# Altium project PCB_Project_4.PrjPcb
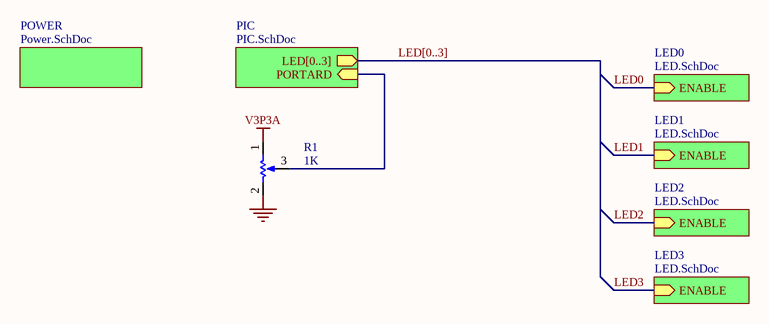
[diagram p0: Sheet4.SchDoc]
4 sheets, 36 parts. Net scope: hierarchical (ports join the sheet entries above them; power ports are global).
Board file: PCB1.PcbDoc
Sheets:
  Sheet4.SchDoc
    LED0 = LED.SchDoc
    LED1 = LED.SchDoc
    LED2 = LED.SchDoc
    LED3 = LED.SchDoc
    PIC = PIC.SchDoc
    POWER = Power.SchDoc

## Sheet Sheet4.SchDoc
size A4

### Parts
R1  1K  [PDB181-K415K-102A2]

### Sub-sheets
LED0 = LED.SchDoc: ENABLE (in)
LED1 = LED.SchDoc: ENABLE (in)
LED2 = LED.SchDoc: ENABLE (in)
LED3 = LED.SchDoc: ENABLE (in)
PIC = PIC.SchDoc: PORTARD (in), LED[0..3] (out)
POWER = Power.SchDoc: no entries

### Nets
GND: R1.2(BOT)
V3P3A: R1.1(TOP)
NetR1_3: R1.3(TAP) ; sheet PIC/PORTARD

### Buses and harness runs
bus LED[0..3] = sheet PIC/LED[0..3]

### Library data of the parts
R1 = RPot: Potentiometer; Fournisseur: Farnell; Fabricant: BOURNS; Ref.Fournisseur: 1823540; Ref.Fabricant: PDB181-K415K-102A2; Valeur: 1K

## Sheet LED.SchDoc
size A
Used 4 times, as channels LED0, LED1, LED2, LED3. Parts and nets are listed once, with the designators drawn on the sheet.
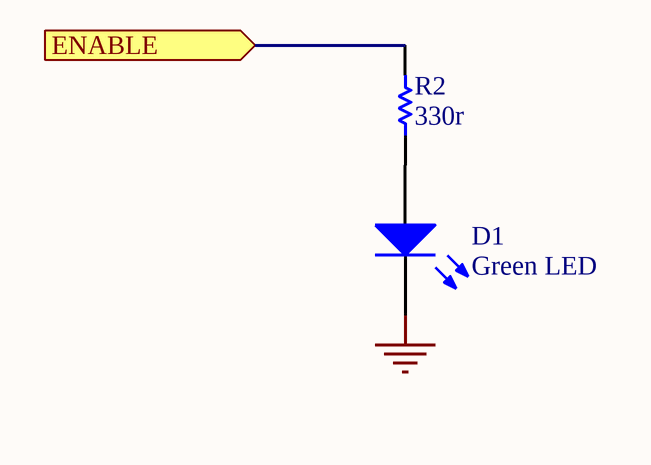
[diagram p1: LED.SchDoc]

### Parts
D1  Green LED  [LED 0805]
R2  330r  [RESC1608N]

### Ports
ENABLE (in)

### Nets
GND: D1.2(K)
ENABLE: R2.2 ; port ENABLE
NetD1_1: D1.1(A) R2.1

### Channels
LED0: designators D1=D1_LED0 R2=R2#1; ports ENABLE=LED0
LED1: designators D1=D1_LED1 R2=R2#2; ports ENABLE=LED1
LED2: designators D1=D1_LED2 R2=R2#3; ports ENABLE=LED2
LED3: designators D1=D1_LED3 R2=R2#4; ports ENABLE=LED3

### Library data of the parts
D1 = LED0: Typical INFRARED GaAs LED; Fournisseur: Farnell; Fabricant: KING BRIGHT; Ref.Fournisseur: 2099239; Ref.Fabricant: KPT-2012SGC
R2 = Res1: Resistor; Value: 1K; Precision: 1%; Published: 8-Jun-2000; LatestRevisionDate: 17-Jul-2002; LatestRevisionNote: Re-released for DXP Platform.; PackageReference: AXIAL-0.3; Publisher: Altium Limited; PackageDescription: Axial Device, Thru-Hole; 2 Leads; 0.3 in Pin Spacing

## Sheet PIC.SchDoc
size A4
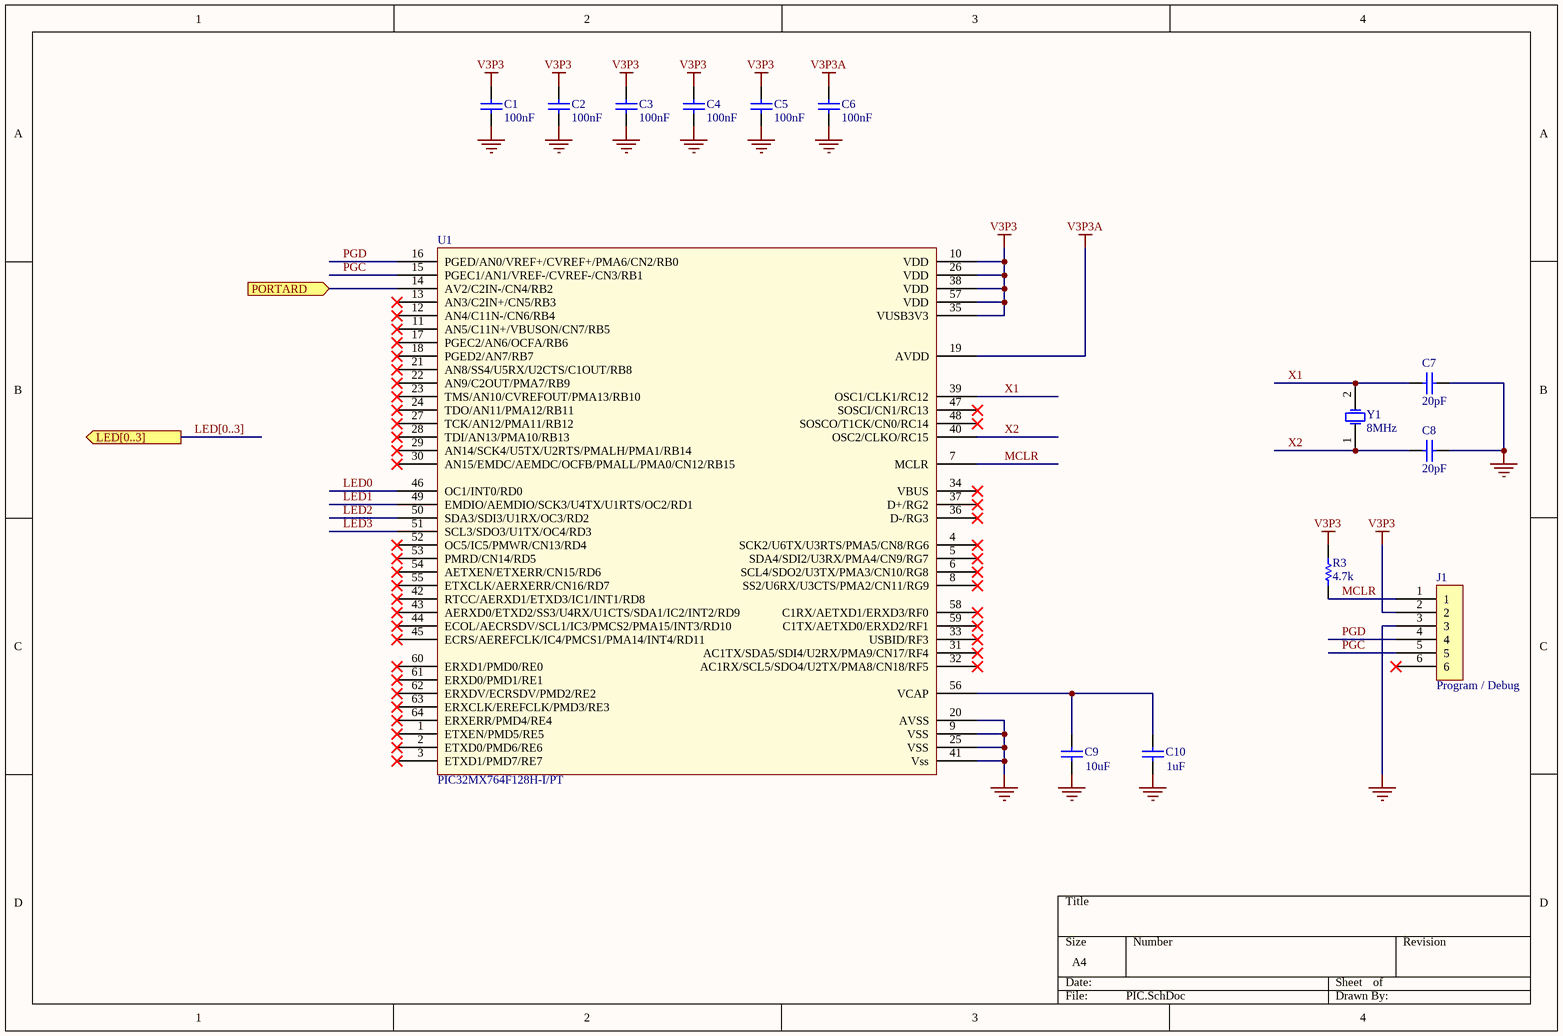
[diagram p2: PIC.SchDoc]

### Parts
C1  100nF  [CAPC1608N]
C2  100nF  [CAPC1608N]
C3  100nF  [CAPC1608N]
C4  100nF  [CAPC1608N]
C5  100nF  [CAPC1608N]
C6  100nF  [CAPC1608N]
C7  20pF  [CAPC1608N]
C8  20pF  [CAPC1608N]
C9  10uF  [CAPC2012N]
C10  1uF  [CAPC1608N]
J1  Program / Debug  [RJ12_90]
R3  4.7k  [RESC1608N]
U1  PIC32MX764F128H-I/PT  [QFP50P1200X1200X120-64]
Y1  8MHz  [HC49/4H SMX Crystal]

### Ports
LED[0..3] (out), PORTARD (in)

### Nets
GND: C1.1 C2.1 C3.1 C4.1 C5.1 C6.1 C7.2 C8.2 C9.1 C10.1 J1.3 U1.9(VSS) U1.20(AVSS) U1.25(VSS) U1.41(Vss)
V3P3: C1.2 C2.2 C3.2 C4.2 C5.2 J1.2 R3.2 U1.10(VDD) U1.26(VDD) U1.35(VUSB3V3) U1.38(VDD) U1.57(VDD)
V3P3A: C6.2 U1.19(AVDD)
LED0: U1.46(OC1/INT0/RD0)
LED1: U1.49(EMDIO/AEMDIO/SCK3/U4TX/U1RTS/OC2/RD1)
LED2: U1.50(SDA3/SDI3/U1RX/OC3/RD2)
LED3: U1.51(SCL3/SDO3/U1TX/OC4/RD3)
MCLR: J1.1 R3.1 U1.7(MCLR)
PGC: J1.5 U1.15(PGEC1/AN1/VREF-/CVREF-/CN3/RB1)
PGD: J1.4 U1.16(PGED/AN0/VREF+/CVREF+/PMA6/CN2/RB0)
X1: C7.1 U1.39(OSC1/CLK1/RC12) Y1.2(OSC2)
X2: C8.1 U1.40(OSC2/CLKO/RC15) Y1.1(OSC1)
NetC9_2: C9.2 C10.2 U1.56(VCAP)
NetR1_3: U1.14(AV2/C2IN-/CN4/RB2) ; port PORTARD

Not connected (* = marked no-connect by the designer): J1 6*; U1 1(ETXEN/PMD5/RE5)* 2(ETXD0/PMD6/RE6)* 3(ETXD1/PMD7/RE7)* 4(SCK2/U6TX/U3RTS/PMA5/CN8/RG6)* 5(SDA4/SDI2/U3RX/PMA4/CN9/RG7)* 6(SCL4/SDO2/U3TX/PMA3/CN10/RG8)* 8(SS2/U6RX/U3CTS/PMA2/CN11/RG9)* 11(AN5/C11N+/VBUSON/CN7/RB5)* 12(AN4/C11N-/CN6/RB4)* 13(AN3/C2IN+/CN5/RB3)* 17(PGEC2/AN6/OCFA/RB6)* 18(PGED2/AN7/RB7)* 21(AN8/SS4/U5RX/U2CTS/C1OUT/RB8)* 22(AN9/C2OUT/PMA7/RB9)* 23(TMS/AN10/CVREFOUT/PMA13/RB10)* 24(TDO/AN11/PMA12/RB11)* 27(TCK/AN12/PMA11/RB12)* 28(TDI/AN13/PMA10/RB13)* 29(AN14/SCK4/U5TX/U2RTS/PMALH/PMA1/RB14)* 30(AN15/EMDC/AEMDC/OCFB/PMALL/PMA0/CN12/RB15)* 31(AC1TX/SDA5/SDI4/U2RX/PMA9/CN17/RF4)* 32(AC1RX/SCL5/SDO4/U2TX/PMA8/CN18/RF5)* 33(USBID/RF3)* 34(VBUS)* 36(D-/RG3)* 37(D+/RG2)* 42(RTCC/AERXD1/ETXD3/IC1/INT1/RD8)* 43(AERXD0/ETXD2/SS3/U4RX/U1CTS/SDA1/IC2/INT2/RD9)* 44(ECOL/AECRSDV/SCL1/IC3/PMCS2/PMA15/INT3/RD10)* 45(ECRS/AEREFCLK/IC4/PMCS1/PMA14/INT4/RD11)* 47(SOSCI/CN1/RC13)* 48(SOSCO/T1CK/CN0/RC14)* 52(OC5/IC5/PMWR/CN13/RD4)* 53(PMRD/CN14/RD5)* 54(AETXEN/ETXERR/CN15/RD6)* 55(ETXCLK/AERXERR/CN16/RD7)* 58(C1RX/AETXD1/ERXD3/RF0)* 59(C1TX/AETXD0/ERXD2/RF1)* 60(ERXD1/PMD0/RE0)* 61(ERXD0/PMD1/RE1)* 62(ERXDV/ECRSDV/PMD2/RE2)* 63(ERXCLK/EREFCLK/PMD3/RE3)* 64(ERXERR/PMD4/RE4)*

### Buses and harness runs
bus LED[0..3] = port LED[0..3]

### Library data of the parts
C1-C8 = Cap: Capacitor; Precision: 50V X5R; Fournisseur: *; Ref. Fournisseur: *; Fabricant: *; Ref. Fabricant: *
  C1-C6: Valeur: 100nF
  C7 C8: Valeur: 20pF
C9 = Cap: Capacitor; Fournisseur: Farnell; Ref.Fournisseur: 2309029; Fabricant: TDK; Ref.Fabricant: C2012X5R0J106M/1.25; Precision: 6.3V X5R 10uF; Valeur: 10uF
C10 = Cap: Capacitor; Precision: 6.3V X5R; Published: 8-Jun-2000; Fournisseur: *; Ref. Fournisseur: *; Fabricant: *; Ref. Fabricant: *; Valeur: 1uF
J1 = Program / Debug: Fournisseur: Farnell; Fabricant: Tyco; Ref.Fournisseur: 1773039; Ref.Fabricant: 1-215876-3
R3 = Res1: Resistor; Precision: 1%; Ref.Fournisseur: *; Ref.Fabricant: *; Fournisseur: *; Fabricant: *; Valeur: 4.7k
U1 = PIC32MX764F128H-I/PT: Fabricant: Microchip; Fournisseur: Farnell; Ref.Fournisseur: 1971889; Ref.Fabricant: PIC32MX764F128H-I/PT
Y1 = XTAL: Crystal Oscillator; Fabricant: FOX ELECTRONICS; Ref.Fabricant: FOXSDLF/080-20; Ref.Fournisseur: 2063972; Fournisseur: Farnell; Valeur: 8MHz

## Sheet Power.SchDoc
size A
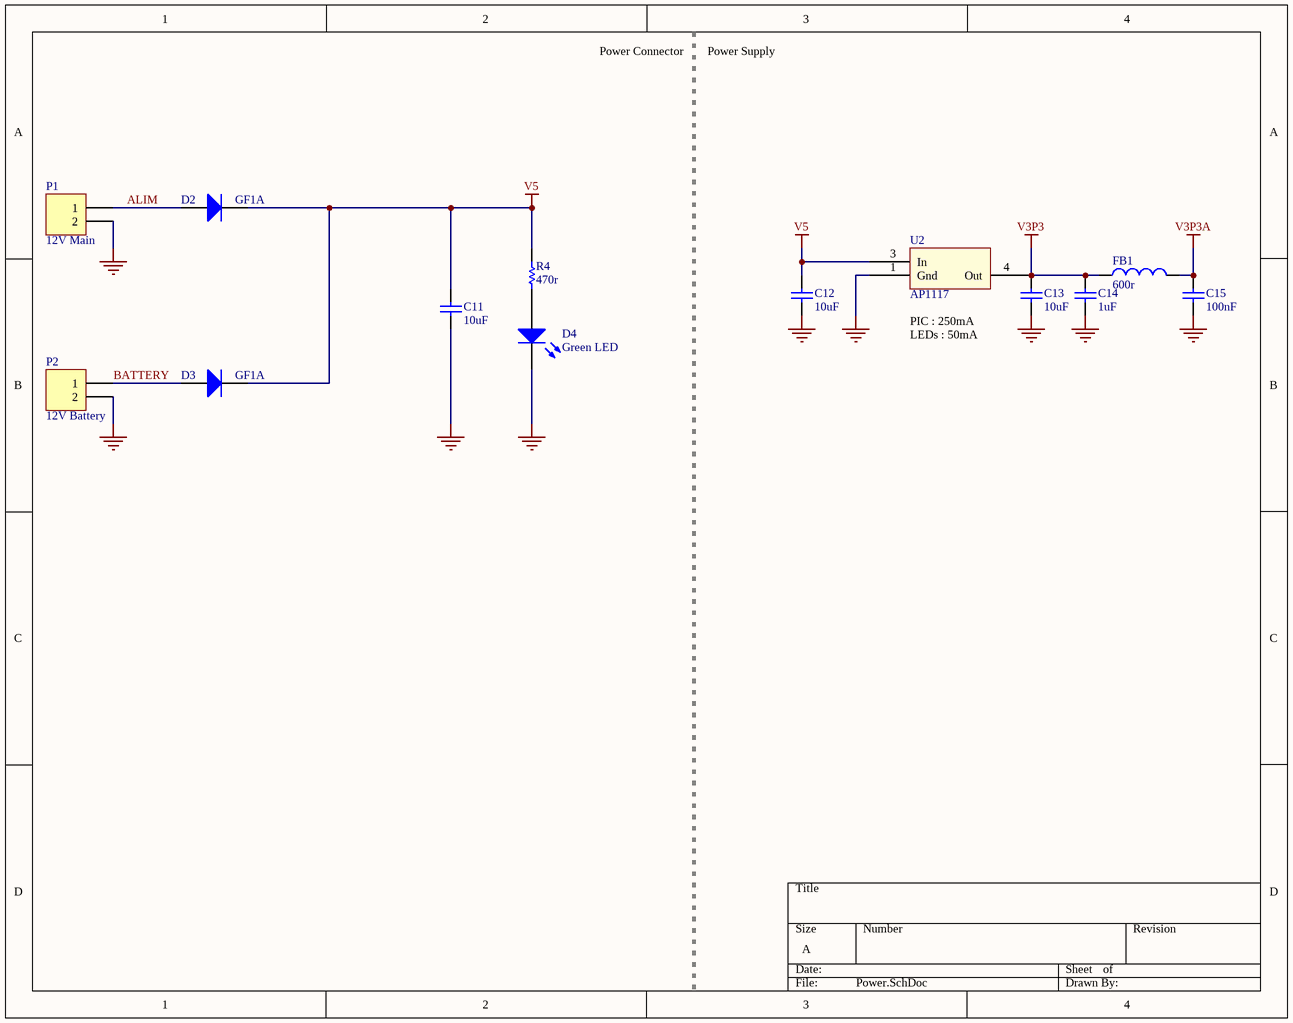
[diagram p3: Power.SchDoc]

### Parts
C11  10uF  [CAPC2012N]
C12  10uF  [CAPC2012N]
C13  10uF  [CAPC2012N]
C14  1uF  [CAPC1608N]
C15  100nF  [CAPC1608N]
D2  GF1A  [214AC_21]
D3  GF1A  [214AC_21]
D4  Green LED  [LED 0805]
FB1  600r  [INDC1608AN]
P1  12V Main  [PHOENIX_1985195]
P2  12V Battery  [PHOENIX_1985195]
R4  470r  [RESC1608N]
U2  AP1117  [TD03B_N]

### Nets
GND: C11.1 C12.1 C13.1 C14.1 C15.1 D4.2(K) P1.2 P2.2 U2.1(Gnd)
V3P3: C13.2 C14.2 FB1.1 U2.4(Out)
V3P3A: C15.2 FB1.2
V5: C11.2 C12.2 D2.2(K) D3.2(K) R4.2 U2.3(In)
ALIM: D2.1(A) P1.1
BATTERY: D3.1(A) P2.1
NetD4_1: D4.1(A) R4.1

### Notes on the sheet
- Power Connector
- Power Supply
- PIC : 250mA
- LEDs : 50mA

### Library data of the parts
C11-C13 = Cap: Capacitor; Fabricant: TDK; Ref.Fabricant: C2012X5R0J106M/1.25; Fournisseur: Farnell; Ref.Fournisseur: 2309029; Precision: 6.3V X5R 10uF; Valeur: 10uF
C14 = Cap: Capacitor; Precision: 6.3V X5R; Valeur: 1uF
C15 = Cap: Capacitor; Precision: 50V X5R; Valeur: 100nF
D2 D3 = Diode: Default Diode; Fournisseur: Farnell; Fabricant: VISHAY; Ref.Fournisseur: 9549560; Ref.Fabricant: 6FIA-E3/67A
D4 = LED0: as D1 on sheet LED
FB1 = Inductor: Ref.Fabricant: 472792651; Ref.Fournisseur: 1635706; Fabricant: WURTH; Fournisseur: Farnell; Valeur: 600r
P1 = Header 2: Header, 2-Pin; Fabricant: PHOENIX CONTACT; Ref.Fabricant: PTSA 1.5/2-3,5-Z; Fournisseur: Farnell; Ref.Fournisseur: 1792769
P2 = Header 2: Header, 2-Pin; Ref.Fournisseur: 1792769; Fournisseur: Farnell; Ref.Fabricant: PTSA 1.5/2-3,5-Z; Fabricant: PHOENIX CONTACT
R4 = Res1: Resistor; Valeur: 4.7k; Precision: 1%
U2 = AP1117: Fabricant: DIODES INC; Fournisseur: Farnell; Ref.Fabricant: AP1117D33G-13; Ref.Fournisseur: 1825285

## Nets that join several sheets
GND: Sheet4 (R1.2), LED0 (D1_LED0.2), LED1 (D1_LED1.2), LED2 (D1_LED2.2), LED3 (D1_LED3.2), PIC (15 pins), Power (9 pins)
V3P3: PIC (12 pins), Power (C13.2 C14.2 FB1.1 U2.4)
V3P3A: Sheet4 (R1.1), PIC (C6.2 U1.19), Power (C15.2 FB1.2)
LED0: LED0 (R2#1.2), PIC (U1.46)
LED1: LED1 (R2#2.2), PIC (U1.49)
LED2: LED2 (R2#3.2), PIC (U1.50)
LED3: LED3 (R2#4.2), PIC (U1.51)
NetR1_3: Sheet4 (R1.3), PIC (U1.14)